# Altium schematic sheet MB542.SchDoc
size A4; Revision: B.2(PCB.SCH)
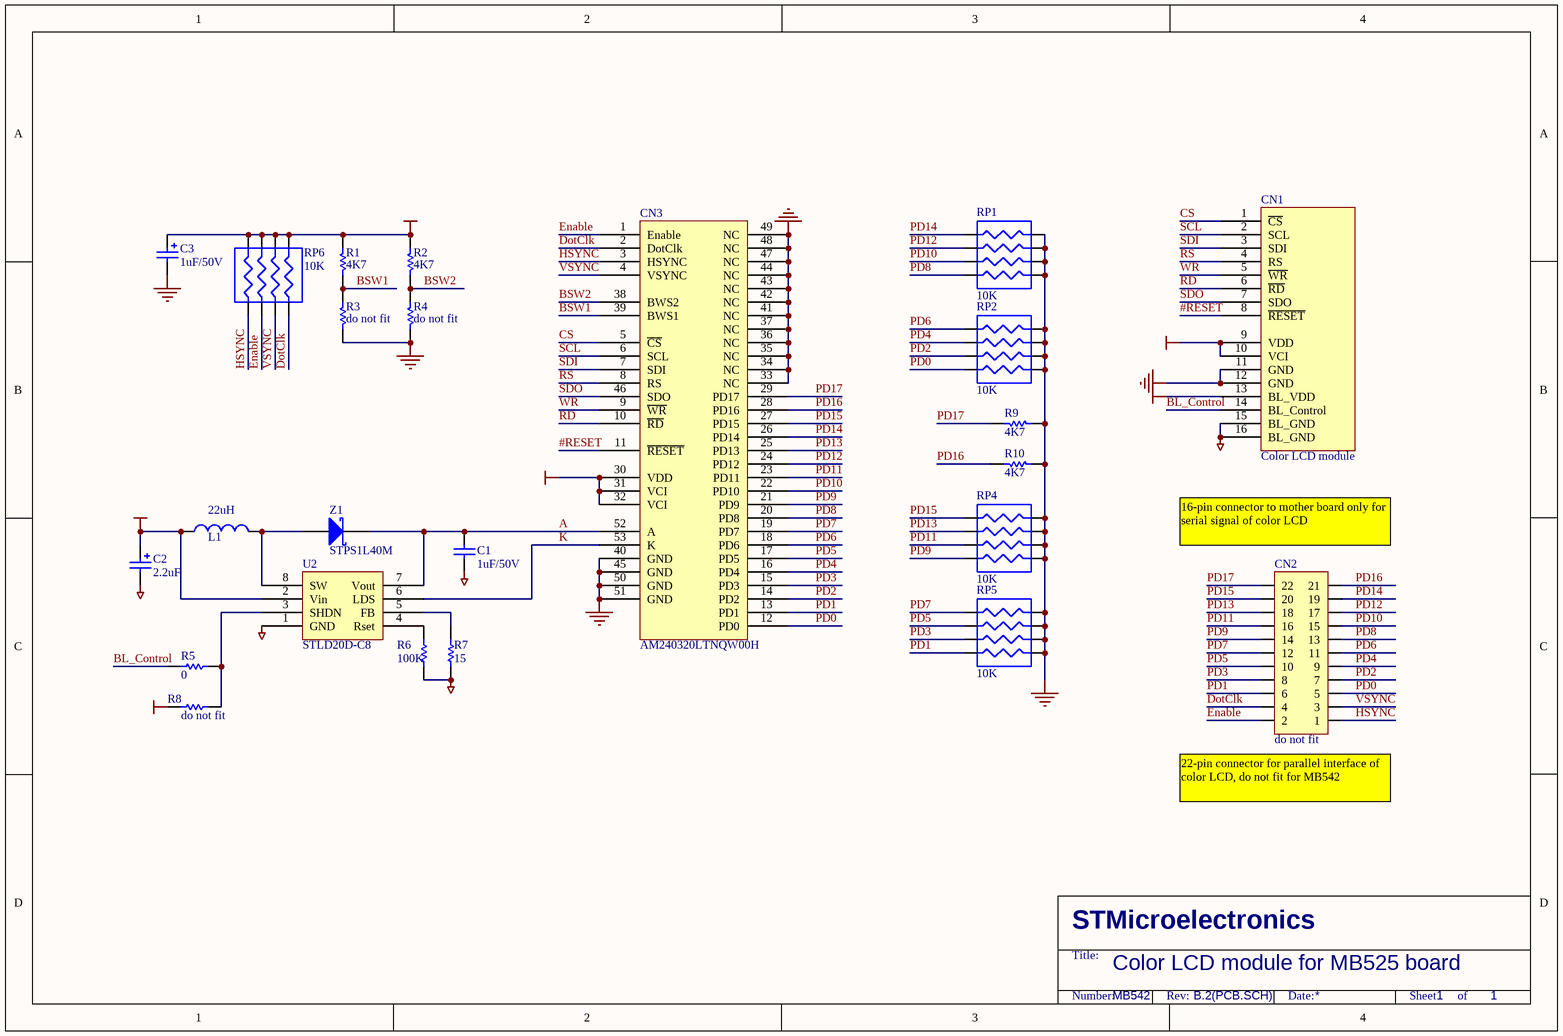
[diagram p0: MB542.SchDoc]

## Parts
C1  1uF/50V  [0603]
C2  2.2uF  [TAN-A]
C3  1uF/50V  [TAN-B]
CN1  Color LCD module  [AM240320A]
CN2  do not fit  [2*11P]
CN3  AM240320LTNQW00H
L1  22uH  [3225]
R1  4K7  [0603]
R2  4K7  [0603]
R3  do not fit  [0603]
R4  do not fit  [0603]
R5  0  [0603]
R6  100K  [0603]
R7  15  [0603]
R8  do not fit  [0603]
R9  4K7  [0603]
R10  4K7  [0603]
RP1  10K  [RES-4B]
RP2  10K  [RES-4B]
RP4  10K  [RES-4B]
RP5  10K  [RES-4B]
RP6  10K  [RES-4B]
U2  STLD20D-C8  [SOT23-8L]
Z1  STPS1L40M  [1R1C]

## Nets
BLGND: C1.1 C2.2 CN1.15(BL_GND) CN1.16(BL_GND) R6.1 R7.1 U2.1(GND)
BLVDD: C2.1 CN1.13(BL_VDD) L1.1 R8.2 U2.2(Vin)
GND: C3.2 CN1.11(GND) CN1.12(GND) CN3.33(NC) CN3.34(NC) CN3.35(NC) CN3.36(NC) CN3.37(NC) CN3.40(GND) CN3.41(NC) CN3.42(NC) CN3.43(NC) CN3.44(NC) CN3.45(GND) CN3.47(NC) CN3.48(NC) CN3.49(NC) CN3.50(GND) CN3.51(GND) R3.1 R4.1 R9.1 R10.1 RP1.2(R1) RP1.4(R3) RP1.6(R2) RP1.8(R0) RP2.2(R1) RP2.4(R3) RP2.6(R2) RP2.8(R0) RP4.2(R1) RP4.4(R3) RP4.6(R2) RP4.8(R0) RP5.2(R1) RP5.4(R3) RP5.6(R2) RP5.8(R0)
VDD: C3.1 CN1.9(VDD) CN1.10(VCI) CN3.30(VDD) CN3.31(VCI) CN3.32(VCI) R1.2 R2.2 RP6.2(R1) RP6.4(R3) RP6.6(R2) RP6.8(R0)
#RESET: CN1.8(~{RESET}) CN3.11(~{RESET})
A: C1.2 CN3.52(A) U2.7(Vout) Z1.2(K)
BL_Control: CN1.14(BL_Control) R5.2
BSW1: CN3.39(BWS1) R1.1 R3.2
BSW2: CN3.38(BWS2) R2.1 R4.2
CS: CN1.1(~{CS}) CN3.5(~{CS})
DotClk: CN2.4 CN3.2(DotClk) RP6.7(R1)
Enable: CN2.2 CN3.1(Enable) RP6.3(R2)
HSYNC: CN2.1 CN3.3(HSYNC) RP6.1(R0)
K: CN3.53(K) U2.6(LDS)
PD0: CN2.5 CN3.12(PD0) RP2.7(R1)
PD1: CN2.6 CN3.13(PD1) RP5.7(R1)
PD2: CN2.7 CN3.14(PD2) RP2.5(R3)
PD3: CN2.8 CN3.15(PD3) RP5.5(R3)
PD4: CN2.9 CN3.16(PD4) RP2.3(R2)
PD5: CN2.10 CN3.17(PD5) RP5.3(R2)
PD6: CN2.11 CN3.18(PD6) RP2.1(R0)
PD7: CN2.12 CN3.19(PD7) RP5.1(R0)
PD8: CN2.13 CN3.20(PD8) RP1.7(R1)
PD9: CN2.14 CN3.21(PD9) RP4.7(R1)
PD10: CN2.15 CN3.22(PD10) RP1.5(R3)
PD11: CN2.16 CN3.23(PD11) RP4.5(R3)
PD12: CN2.17 CN3.24(PD12) RP1.3(R2)
PD13: CN2.18 CN3.25(PD13) RP4.3(R2)
PD14: CN2.19 CN3.26(PD14) RP1.1(R0)
PD15: CN2.20 CN3.27(PD15) RP4.1(R0)
PD16: CN2.21 CN3.28(PD16) R10.2
PD17: CN2.22 CN3.29(PD17) R9.2
RD: CN1.6(~{RD}) CN3.10(~{RD})
RS: CN1.4(RS) CN3.8(RS)
SCL: CN1.2(SCL) CN3.6(SCL)
SDI: CN1.3(SDI) CN3.7(SDI)
SDO: CN1.7(SDO) CN3.46(SDO)
VSYNC: CN2.3 CN3.4(VSYNC) RP6.5(R3)
WR: CN1.5(~{WR}) CN3.9(~{WR})
NetL1_2: L1.2 U2.8(SW) Z1.1(A)
NetR5_1: R5.1 R8.1 U2.3(SHDN)
NetR6_2: R6.2 U2.4(Rset)
NetR7_2: R7.2 U2.5(FB)

## Notes on the sheet
- 16-pin connector to mother board only for serial signal of color LCD
- (near CN2) 22-pin connector for parallel interface of color LCD, do not fit for MB542
- Color LCD module for MB525 board
- MB542
- 1
- STMicroelectronics
- Title:
- Number:
- Rev:
- Date:
- Sheet       of

## Library data of the parts
C1 = CAP: Capacitor; Value: 100pF; Published: 8-Jun-2000; Revision: July-2002: Re-released for DXP Platform.; Publisher: Altium Limited
C2 C3 = Cap Pol1: Polarized Capacitor (Radial); Value: 100pF; Published: 8-Jun-2000; Revision: July-2002: Re-released for DXP Platform.; Publisher: Altium Limited
CN1 = ColorLCD_module
CN2 = IDC22: Part Field 1: 17-Jul-2002: Re-released for DXP Platform.; Part Field 2: Altium Limited
L1 = Inductor: Value: 100uH; Published: 8-Jun-2000; Revision: July-2002: Re-released for DXP Platform.; Publisher: Altium Limited
R1-R10 = Res1: Resistor; Value: 1K; Published: 8-Jun-2000; Revision: July-2002: Re-released for DXP Platform.; Publisher: Altium Limited
RP1 RP2 RP4-RP6 = RES4B
Z1 = D Schottky: Schottky Diode; Code - JEDEC: DO-214-AA; Published: 8-Jun-2000; Revision: July-2002: Re-released for DXP Platform.; Publisher: Altium Limited